# EAGLE board ESP32 Display-1.46-V1.0 (EAGLE 9.6.2), part 1 of 2
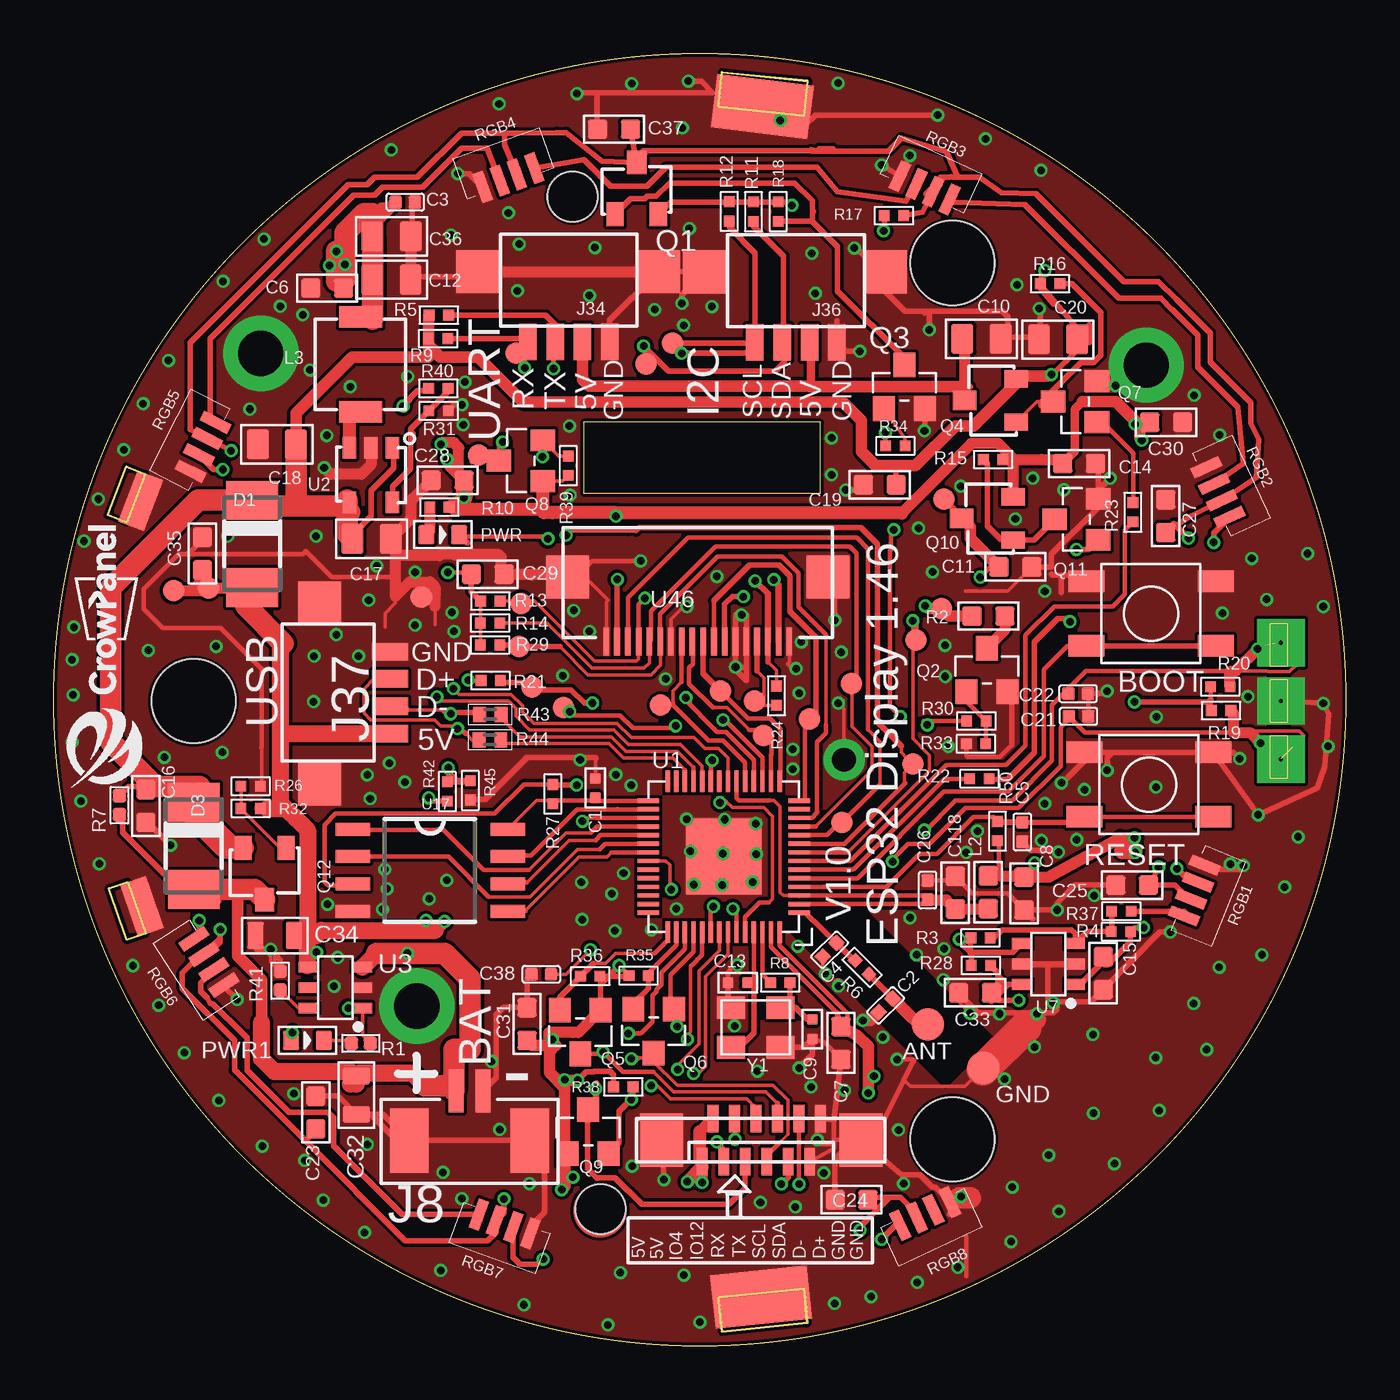
[diagram p6: board, top side]
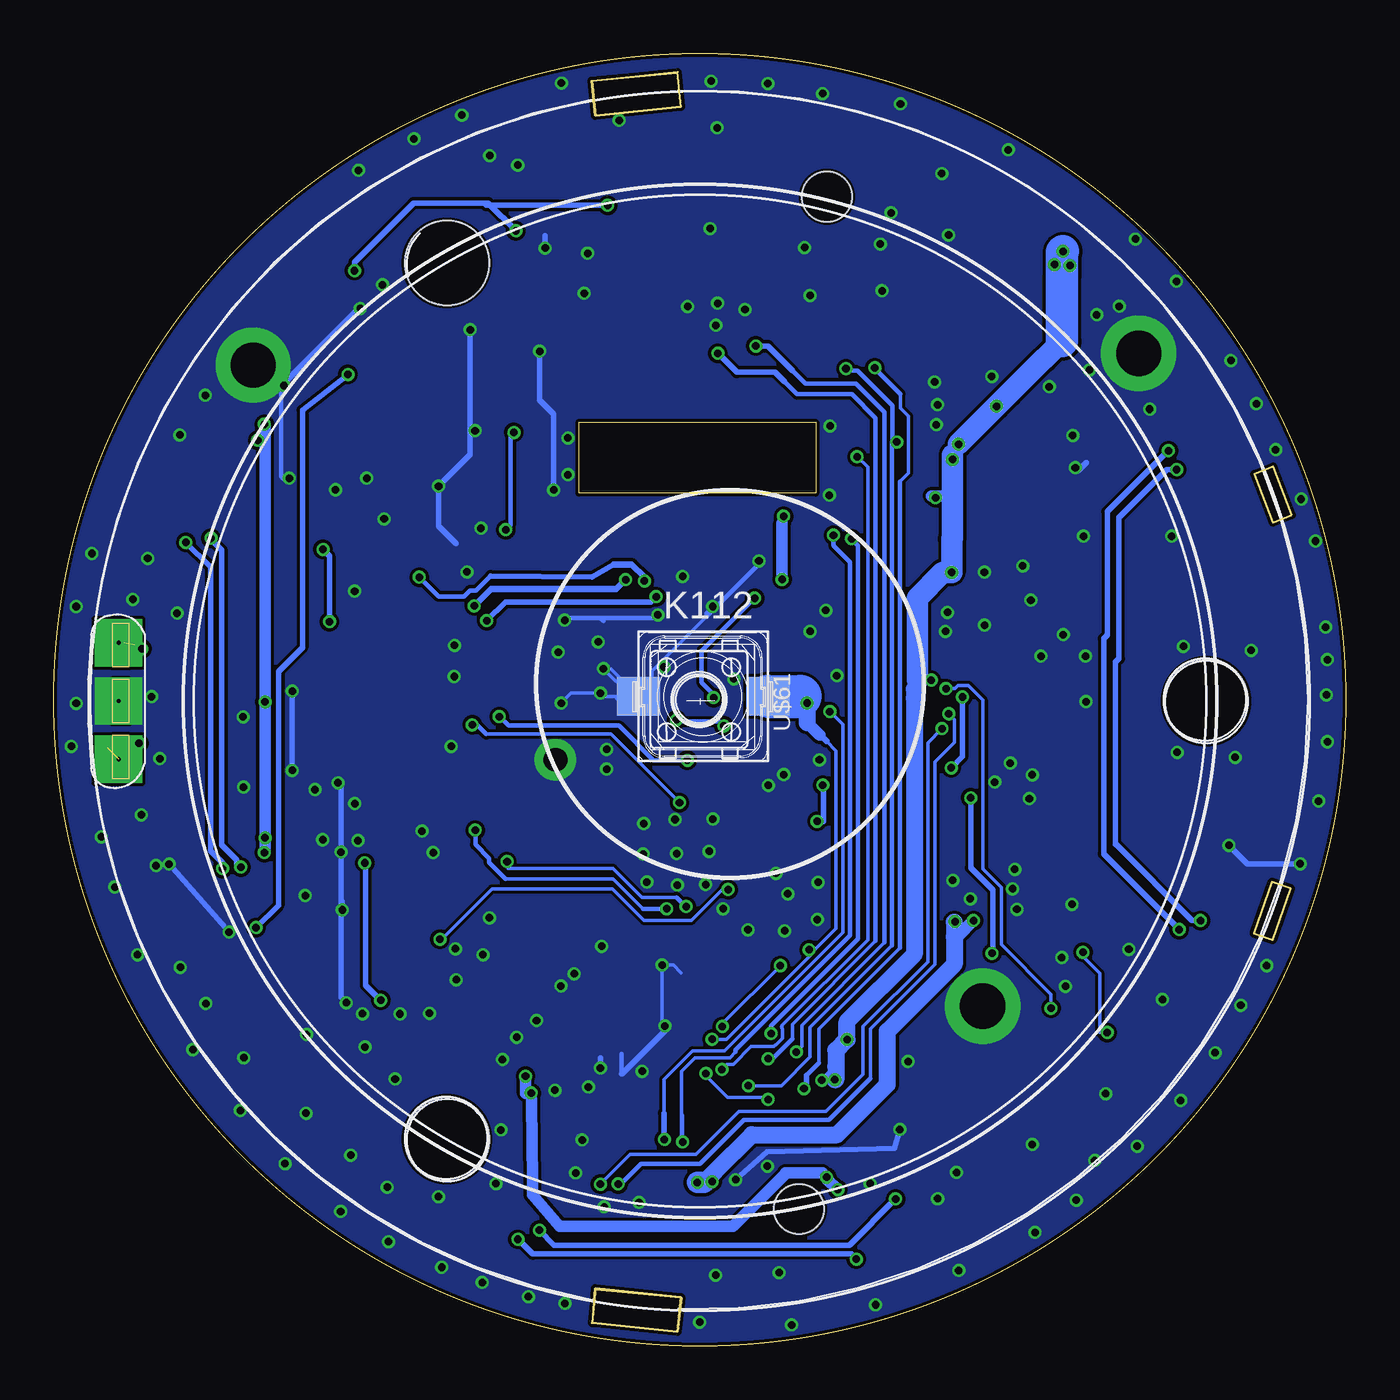
[diagram p7: board, bottom side, seen from below]

Size 60 x 60 mm. Coordinates in mm from the lower left corner, seen from the top.
Outline: 24.61,42.89 24.61,39.59 35.61,39.59 35.61,42.89 24.61,42.89
Outline: circle at 30,30 radius 30
Copper layers (1*16): Top 0.035mm / dielectric 1.5mm / Bottom 0.035mm
Design rules "default *": minimum track width 5mil, minimum drill 0.3mm, track to track 5mil, track to pad 5mil, pad to pad 5mil, via to via 5mil, smd to smd 5mil, copper to edge 6mil, drill to drill 6mil, minimum pad ring 5mil, minimum via ring 5mil, stop-mask expansion 4mil, vias tented up to drill 30mil, thermal gap 5mil
Net classes: 0 default: width 0.152 mm, drill 0.254 mm, clearance 0.15 mm; 1 PWR: width 0.254 mm, drill 0.254 mm, clearance 0.15 mm to class 0, clearance 0.5 mm; 2 GND: width 0.254 mm, drill 0.305 mm, clearance 0.305 mm to class 0, clearance 0.508 mm to class 1, clearance 0.508 mm; 3 New Class: width 0.152 mm, drill 0.152 mm, clearance 0.152 mm to class 0, clearance 0.152 mm to class 1, clearance 0.152 mm to class 2, clearance 0.152 mm

## Footprints (pad centres in the part's own frame; a part is rotated, then mirrored left to right if it is on the bottom)
TEST_PAD-1.5MM = smd 1.5 x 1.5: P$1 0,0
SW-4.5*4.5 = smd 1.676 x 1: P$1 -3,1.5; P$2 -3,-1.5; P$3 3,-1.5; P$4 3,1.5
0402 = smd 0.5 x 0.5: 1 -0.45,0; 2 0.45,0
C0402 = smd 0.6 x 0.6: 1 -0.45,0; 2 0.45,0
0603 = smd 0.889 x 0.889: 1 -0.762,0; 2 0.762,0
C0603 = smd 0.889 x 0.889: 1 -0.762,0; 2 0.762,0
0805 = smd 1.016 x 1.397: 1 -0.889,0; 2 0.889,0
0805_S = smd 0.762 x 1.27: 1 -0.889,0; 2 0.889,0
DO-214AC = smd 1.8 x 2.4: A 2.025,0; C -2.025,0
CROWBOT-V1.0库_1.25MM-2PIN = smd 0.7 x 2: 1+ -0.625,2.3; 2 0.625,2.3 | smd 1.8 x 3: 3 -2.8,0; 4 2.8,0
1.25-4P立贴 = smd 0.813 x 1.676: 1 1.27,2; 2 0,2; 3 -1.27,2; 4 -2.54,2 | smd 2 x 2: 5 -4.8,-1.27; 6 3.6,-1.27
CROWPI_POW_BUTTON_2P = smd 2 x 1.8: P$1 0,0; P$2 6,0
L0603 = smd 0.889 x 0.889: 1 -0.762,0; 2 0.762,0
L0420 = smd 2 x 1: 1 0,2.2; 2 0,-2.2
PAD-1.0MM = smd 1 x 1: P$1 0,0
LED-0603 = smd 0.762 x 0.889: + -0.762,0; - 0.762,0
SOT-23 = smd 1.1 x 0.8: 1 1.2,-1; 2 1.2,1 | smd 1.1 x 0.9: 3 -1.2,0
SOT23 = smd 1.016 x 1.143: 1 -0.95,-1.016; 2 0.95,-1.016; 3 0,1.016
SOT23@1 = smd 1.016 x 1.143: 1 -0.95,-1.016; 2 0.95,-1.016; 3 0,1.016
R0402 = smd 0.635 x 0.635: 1 -0.445,0; 2 0.445,0
R0603 = smd 0.889 x 0.889: 1 -0.762,0; 2 0.762,0
0402' = smd 0.5 x 0.5: P$1 -0.45,0; P$2 0.45,0
R0402' = smd 0.6 x 0.7: 1 -0.5,0; 2 0.5,0
RGB4020 = smd 0.5 x 1.422: 1 0,0; 2 -0.85,0; 3 -1.7,0; 4 -2.55,0
T-2.5 = drill 2.1 pad 3.5: 1 0,0
ESP-S3-QFN56(7×7MM) = smd 1 x 0.2: 1 -3.5,2.6; 2 -3.5,2.2; 3 -3.5,1.8; 4 -3.5,1.4; 5 -3.5,1; 6 -3.5,0.6; 7 -3.5,0.2; 8 -3.5,-0.2; 9 -3.5,-0.6; 10 -3.5,-1; 11 -3.5,-1.4; 12 -3.5,-1.8; 13 -3.5,-2.2; 14 -3.5,-2.6; 29 3.5,-2.6; 30 3.5,-2.2; 31 3.5,-1.8; 32 3.5,-1.4; 33 3.5,-1; 34 3.5,-0.6; 35 3.5,-0.2; 36 3.5,0.2; 37 3.5,0.6; 38 3.5,1; 39 3.5,1.4; 40 3.5,1.8; 41 3.5,2.2; 42 3.5,2.6 | smd 0.2 x 1: 15 -2.6,-3.5; 16 -2.2,-3.5; 17 -1.8,-3.5; 18 -1.4,-3.5; 19 -1,-3.5; 20 -0.6,-3.5; 21 -0.2,-3.5; 22 0.2,-3.5; 23 0.6,-3.5; 24 1,-3.5; 25 1.4,-3.5; 26 1.8,-3.5; 27 2.2,-3.5; 28 2.6,-3.5; 43 2.6,3.5; 44 2.2,3.5; 45 1.8,3.5; 46 1.4,3.5; 47 1,3.5; 48 0.6,3.5; 49 0.2,3.5; 50 -0.2,3.5; 51 -0.6,3.5; 52 -1,3.5; 53 -1.4,3.5; 54 -1.8,3.5; 55 -2.2,3.5; 56 -2.6,3.5 | smd 3.5 x 3.5: 57 0,0
SOT23-5 = smd 1 x 0.635: 1 -1.27,1; 2 -1.27,0; 3 -1.27,-1; 4 1.27,-1; 5 1.27,1
SOT23-6L = smd 0.5 x 0.9: 1 -0.961,-1.212; 2 -0.011,-1.212; 3 0.94,-1.212; 4 0.94,1.288; 5 -0.011,1.288; 6 -0.961,1.288
FLASHSOP8_SOP8 = smd 0.6 x 1.6: 1 -1.905,-3.6; 2 -0.635,-3.6; 3 0.635,-3.6; 4 1.905,-3.6; 5 1.905,3.6; 6 0.635,3.6; 7 -0.635,3.6; 8 -1.905,3.6
CON-0.5-12P-U = smd 0.5 x 1.27: P$1 0,-2; P$2 0.5,0; P$3 1,-2; P$4 1.5,0; P$5 2,-2; P$6 2.5,0; P$7 3,-2; P$8 3.5,0; P$9 4,-2; P$10 4.5,0; P$11 5,-2; P$12 5.5,0 | smd 2 x 2.5: P$13 -1.88,-1; P$14 7.38,-1
0.5MM-18P = smd 0.27 x 1.27: 1 8.5,0; 2 8,0; 3 7.5,0; 4 7,0; 5 6.5,0; 6 6,0; 7 5.5,0; 8 5,0; 9 4.5,0; 10 4,0; 11 3.5,0; 12 3,0; 13 2.5,0; 14 2,0; 15 1.5,0; 16 1,0; 17 0.5,0; 18 0,0 | smd 2 x 2: P$19 -1.8,-3; P$20 10.3,-3
EC5602-CC = drill 0.2 pad 2.2 square: 8 -2.7,-27; 9 0,-27; 10 2.7,-27 | smd 4.5 x 2.5 rotated 97 bottom: P$1 -27.62,-2.92 | smd 4.5 x 2.5 rotated 84 bottom: P$2 27.68,-2.86 | smd 2.54 x 1.27 rotated 200.8 bottom: P$3 -9.3,25.96 | smd 2.54 x 1.27 rotated 160.8 bottom: P$4 9.54,25.9 | hole 3.9: 0,23.5; -20.35,-11.75; 20.35,-11.75 | hole 2.3: 23.6,4.6; -23.424,5.9
T-2-1.1 = drill 1.1 pad 1.93: P$1 0,0
CRYSTAL-3.2-2.5 = smd 1.3 x 1.05: 1 -1.15,-0.925; 2 1.15,-0.925; 3 1.15,0.925; 4 -1.15,0.925

## Placement (x,y rotation side)
ANT  TEST_PADPAD-1.5MM  [TEST_PAD-1.5MM]  40.6,14.93 0 top
BOOT  BOOT  [SW-4.5*4.5]  50.96,34 0 top
C1  1UF  [0402]  25.15,25.9 90 top
C2  0.75pF  [C0402]  38.63,15.81 45 top
C3  1uF  [C0402]  16.32,53.11 180 top
C4  NC  [C0402]  36.03,18.39 45 top
C5  1uF  [C0402]  44.98,23.86 90 top
C6  100NF  [0603]  12.7,49.12 180 top
C7  1uF  [C0603]  36.56,14.06 270 top
C8  10NF  [C0603]  45.06,21 270 top
C9  12pF  [0402]  35.23,14.7 270 top
C10  22uF  [0805]  43.08,46.76 180 top
C11  100NF  [0603]  44.66,36.17 0 top
C12  22uF  [0805]  15.68,49.51 180 top
C13  12pF  [0402]  31.76,16.86 180 top
C14  100NF  [C0603]  47.62,40.97 0 top
C15  100NF  [0603]  48.74,17.3 270 top
C16  100NF  [0603]  4.28,25.06 270 top
C17  22uF  [0805]  14.76,37.47 180 top
C18  22uF  [0805]  10.36,41.86 0 top
C19  100NF  [0603]  38.36,39.99 180 top
C20  22uF  [0805]  46.64,46.73 0 top
C21  1uF  [C0402]  47.59,29.23 180 top
C22  1uF  [C0402]  47.57,30.28 180 top
C23  100NF  [0603]  12.17,10.83 90 top
C24  100NF  [0603]  37.05,6.78 180 top
C25  100NF  [0603]  50.08,21.39 180 top
C26  1uF  [C0402]  40.58,21.16 90 top
C27  100NF  [0603]  51.64,38.53 90 top
C28  100NF  [0603]  18.29,40.19 180 top
C29  100NF  [0603]  20.15,35.83 0 top
C30  100NF  [0603]  51.66,42.89 0 top
C31  100NF  [0603]  21.98,14.94 90 top
C32  10uF  [0805_S]  14.05,11.63 90 top
C33  100NF  [0603]  42.79,16.39 180 top
C34  10uF  [0805_S]  10.26,19.05 0 top
C35  100nF  [C0603]  6.9,36.79 90 top
C36  22uF  [0805]  15.69,51.52 180 top
C37  100NF  [0603]  26.02,56.5 180 top
C38  1uF  [C0402]  22.64,17.25 0 top
C118  10uF  [0603]  41.87,21.04 270 top
D1  IN5817  [DO-214AC]  9.21,37.24 270 top
D3  IN5817  [DO-214AC]  6.5,23.21 270 top
GND  TEST_PADPAD-1.5MM  [TEST_PAD-1.5MM]  43.18,12.9 0 top
J8  1.25MM-2PIN  [CROWBOT-V1.0库_1.25MM-2PIN]  19.31,9.53 0 top
J34  1.25-4P-SMT-A  [1.25-4P立贴]  23.28,48.62 180 top
J36  1.25-4P-SMT-A  [1.25-4P立贴]  33.83,48.6 180 top
J37  1.25-4P-SMT-A  [1.25-4P立贴]  13.61,29.7 270 top
K112  SW-66-2P  [CROWPI_POW_BUTTON_2P]  32.84,30.16 0 bottom
L2  100M-600R  [L0603]  43.4,21.06 270 top
L3  2.2UH  [L0420]  14.24,45.58 180 top
P1  [PAD-1.0MM]  41.23,34.23 0 top
P2  [PAD-1.0MM]  41.33,39.32 0 top
P3  [PAD-1.0MM]  40.05,32.78 0 top
P4  [PAD-1.0MM]  35.1,29.11 0 top
P5  [PAD-1.0MM]  30.97,30.4 0 top
P6  [PAD-1.0MM]  32.96,28.35 0 top
P7  [PAD-1.0MM]  28.18,29.75 0 top
P8  [PAD-1.0MM]  21.69,34.47 0 top
P9  [PAD-1.0MM]  21.6,32.47 0 top
P10  [PAD-1.0MM]  37.04,30.75 0 top
P11  [PAD-1.0MM]  36.61,24.31 0 top
P12  [PAD-1.0MM]  39.9,27.02 0 top
P13  [PAD-1.0MM]  23.67,29.64 0 top
P14  [PAD-1.0MM]  21.47,46.11 0 top
P15  [PAD-1.0MM]  19.72,41.36 0 top
P16  [PAD-1.0MM]  28.73,46.56 0 top
P17  [PAD-1.0MM]  27.51,45.6 0 top
P18  [PAD-1.0MM]  22.22,30.6 0 top
P19  [PAD-1.0MM]  5.56,35.07 0 top
P20  [PAD-1.0MM]  7.19,35.19 90 top
P21  [PAD-1.0MM]  17.07,34.77 0 top
P22  [PAD-1.0MM]  32.55,29.94 0 top
PWR  Green  [LED-0603]  18.06,37.67 0 top
PWR1  Green  [LED-0603]  11.78,14.18 0 top
Q1  PMOS-3401-4A  [SOT-23]  27.07,53.75 270 top
Q2  BSN20  [SOT23]  43.34,31.38 0 top
Q3  S9013  [SOT23@1]  39.5,44.54 0 top
Q4  PMOS-3401-4A  [SOT-23]  43.5,43.9 0 top
Q5  BSN20  [SOT23]  24.45,14.57 180 top
Q6  BSN20  [SOT23]  27.86,14.61 180 top
Q7  S9013  [SOT23@1]  47.43,43.85 90 top
Q8  BSN20  [SOT23]  21.69,41.1 90 top
Q9  BSN20  [SOT23]  24.82,9.94 0 top
Q10  PMOS-3401-4A  [SOT-23]  43.36,38.42 0 top
Q11  S9013  [SOT23@1]  47.49,38.38 90 top
Q12  PMOS-3401-4A  [SOT-23]  9.79,21.92 90 top
R1  10K  [R0402]  14.26,14.04 0 top
R2  5.1R  [R0603]  43.41,33.89 180 top
R3  NC  [0402']  43.04,18.94 180 top
R4  10K  [0402']  49.56,19.23 0 top
R5  10k  [0402']  17.88,47.86 180 top
R6  0R  [0402']  37.54,17.57 135 top
R7  470K  [R0402]  3.05,25.1 90 top
R8  24nH  [0402']  33.74,16.86 0 top
R9  10k  [0402']  17.85,46.77 180 top
R10  1K  [0402']  17.91,38.95 0 top
R11  10k  [0402']  32.5,52.67 90 top
R12  10k  [0402']  31.37,52.68 90 top
R13  10K  [0402']  20.27,34.59 0 top
R14  10K  [0402']  20.26,33.56 0 top
R15  10K  [0402']  43.63,41.16 0 top
R16  10K  [0402']  46.27,49.32 180 top
R17  NC  [0402']  39.02,52.48 0 top
R18  10K  [0402']  33.64,52.67 90 top
R19  10K  [0402']  54.21,29.5 180 top
R20  10K  [0402']  54.18,30.6 180 top
R21  10K  [0402']  20.29,30.89 180 top
R22  10K  [0402']  42.99,26.33 180 top
R23  10K  [0402']  50.11,38.71 270 top
R24  0R  [0402']  33.56,30.19 270 top
R26  10K  [0402']  9.14,25.98 180 top
R27  10K  [0402']  23.17,25.62 90 top
R28  4.7K  [0402']  43.06,17.66 0 top
R29  10K  [0402']  20.26,32.54 0 top
R30  10K  [0402']  42.85,29.01 0 top
R31  27K  [0402']  17.87,43.42 180 top
R32  1K  [0402']  9.14,24.95 0 top
R33  100K  [0402']  42.83,27.96 0 top
R34  10K  [0402']  39.09,41.79 180 top
R35  10k  [0402']  27.16,17.19 180 top
R36  10k  [0402']  24.91,17.16 180 top
R37  100R  [0402']  49.58,20.18 180 top
R38  10k  [0402']  26.45,12.02 180 top
R39  10k  [0402']  23.89,40.87 90 top
R40  120K  [0402']  17.86,44.46 180 top
R41  2K  [R0402]  10.51,16.95 270 top
R42  1K  [0402']  18.28,25.74 90 top
R43  10R  [R0402']  20.27,29.32 0 top
R44  10R  [R0402']  20.26,28.14 0 top
R45  1K  [0402']  19.34,25.79 270 top
R50  10K  [0402']  43.83,23.9 90 top
RESET  RESET  [SW-4.5*4.5]  50.86,26.06 180 top
RGB1  RGB4020_E  [RGB4020]  52.5,19.96 248 top
RGB2  RGB4020_E  [RGB4020]  54.61,38.49 295 top
RGB3  RGB4020_E  [RGB4020]  41.61,53.24 335 top
RGB4  RGB4020_E  [RGB4020]  22.31,54.69 20 top
RGB5  RGB4020_E  [RGB4020]  7.51,42.89 63 top
RGB6  RGB4020_E  [RGB4020]  6.51,18.89 123 top
RGB7  RGB4020_E  [RGB4020]  19.74,6.09 160 top
RGB8  RGB4020_E  [RGB4020]  39.31,5.59 205 top
T1  T2.5-A  [T-2.5]  9.61,46.09 0 top
T2  T2.5-A  [T-2.5]  50.74,45.54 0 top
T3  T2.5-A  [T-2.5]  16.86,15.77 0 top
U1  ESP-S3-QFN56(7×7MM)  [ESP-S3-QFN56(7×7MM)]  31.11,22.71 180 top
U2  RY3420  [SOT23-5]  14.73,40.43 270 top
U3  TP4059-SOT23-6  [SOT23-6L]  13.12,16.64 90 top
U7  AIP74LVC1T45GB236  [SOT23-6L]  46.23,17.74 90 top
U17  FLASHSOP8_GD25Q128ESIG  [FLASHSOP8_SOP8]  17.48,22.08 270 top
U27  CON-12P-0.5-U  [CON-0.5-12P-U]  30.11,10.55 0 top
U46  0.5-18P-SMT-AB  [0.5MM-18P]  34.16,32.7 180 top
U$9  [LOGO-1.46]  2.23,30.9 90 top
U$51  [LOGO公司图标]  1.56,28.03 90 top
U$61  EC5602-CC  [EC5602-CC]  29.99,29.94 270 bottom
U$64  T-2-1.1  [T-2-1.1]  36.7,27.21 0 top
Y1  3225_40M  [CRYSTAL-3.2-2.5]  32.6,14.78 180 top